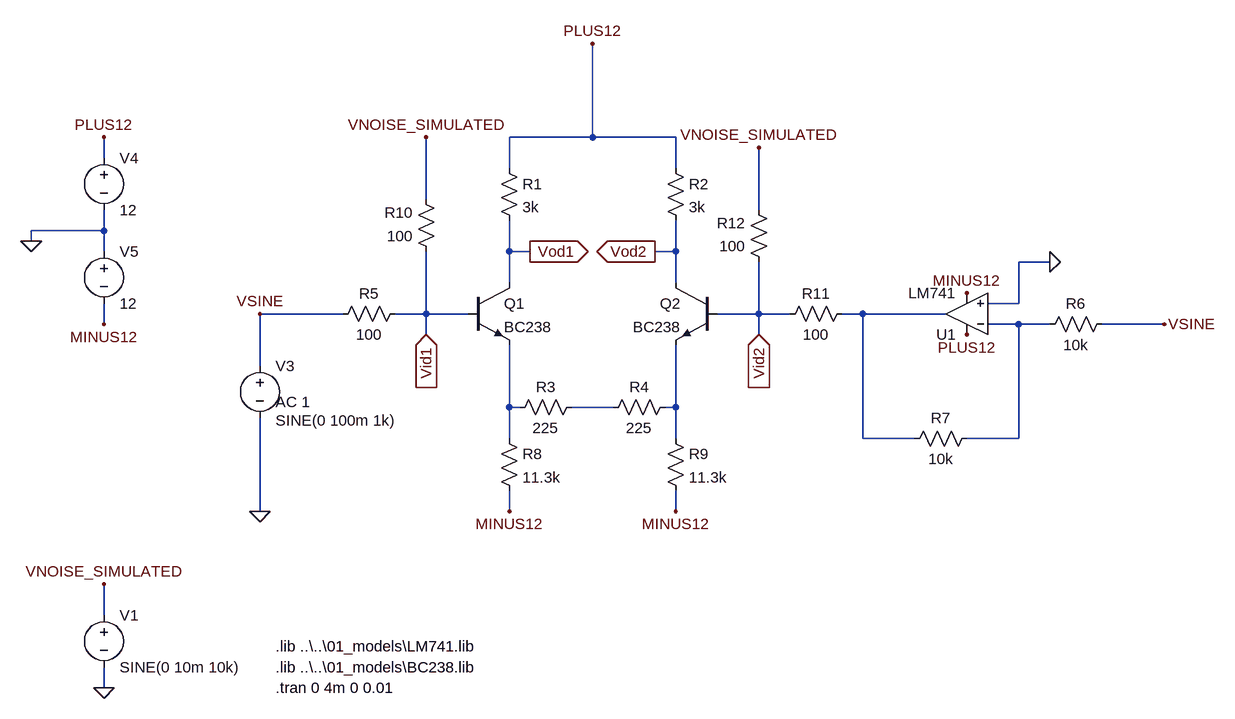
[diagram p0: schematic 02_diff_amp_tail_resistor_20201213_2225.asc]
02_diff_amp_tail_resistor_20201213_2225.asc, the LTspice schematic file:
Version 4
SHEET 1 1512 680
WIRE 32 -192 32 -336
WIRE 32 -192 -96 -192
WIRE 160 -192 32 -192
WIRE -720 -160 -720 -192
WIRE -96 -144 -96 -192
WIRE 160 -144 160 -192
WIRE -224 -96 -224 -192
WIRE 288 -80 288 -176
WIRE -720 -48 -720 -80
WIRE -720 -48 -832 -48
WIRE -832 -32 -832 -48
WIRE -720 -16 -720 -48
WIRE -96 -16 -96 -64
WIRE -64 -16 -96 -16
WIRE 160 -16 160 -64
WIRE 160 -16 128 -16
WIRE 736 0 688 0
WIRE -96 32 -96 -16
WIRE 160 32 160 -16
WIRE 688 64 688 0
WIRE 688 64 640 64
WIRE -352 80 -480 80
WIRE -224 80 -224 -16
WIRE -224 80 -272 80
WIRE -160 80 -224 80
WIRE 288 80 288 0
WIRE 288 80 224 80
WIRE 336 80 288 80
WIRE 448 80 416 80
WIRE 576 80 448 80
WIRE -720 96 -720 64
WIRE 688 96 640 96
WIRE 736 96 688 96
WIRE 912 96 816 96
WIRE -224 112 -224 80
WIRE 288 112 288 80
WIRE -480 160 -480 80
WIRE -96 224 -96 128
WIRE -80 224 -96 224
WIRE 64 224 0 224
WIRE 160 224 160 128
WIRE 160 224 144 224
WIRE -96 272 -96 224
WIRE 160 272 160 224
WIRE 448 272 448 80
WIRE 528 272 448 272
WIRE 688 272 688 96
WIRE 688 272 608 272
WIRE -480 384 -480 240
WIRE -96 384 -96 352
WIRE 160 384 160 352
WIRE -720 544 -720 496
WIRE -720 656 -720 624
FLAG -480 384 0
FLAG -832 -32 0
FLAG -720 -192 PLUS12
FLAG -720 96 MINUS12
FLAG 736 0 0
FLAG 608 48 MINUS12
FLAG 608 112 PLUS12
FLAG -96 384 MINUS12
FLAG 160 384 MINUS12
FLAG 32 -336 PLUS12
FLAG -480 80 VSINE
FLAG 912 96 VSINE
FLAG -720 656 0
FLAG -720 496 VNOISE_SIMULATED
FLAG -224 -192 VNOISE_SIMULATED
FLAG 288 -176 VNOISE_SIMULATED
FLAG -64 -16 Vod1
IOPIN -64 -16 Out
FLAG 128 -16 Vod2
IOPIN 128 -16 Out
FLAG -224 112 Vid1
IOPIN -224 112 In
FLAG 288 112 Vid2
IOPIN 288 112 In
SYMBOL res -112 -160 R0
SYMATTR InstName R1
SYMATTR Value 3k
SYMBOL res 144 -160 R0
SYMATTR InstName R2
SYMATTR Value 3k
SYMBOL voltage -480 144 R0
WINDOW 3 24 100 Left 2
WINDOW 123 24 72 Left 2
WINDOW 39 0 0 Left 2
SYMATTR Value SINE(0 100m 1k)
SYMATTR Value2 AC 1
SYMATTR InstName V3
SYMBOL voltage -720 -176 R0
SYMATTR InstName V4
SYMATTR Value 12
SYMBOL voltage -720 -32 R0
SYMATTR InstName V5
SYMATTR Value 12
SYMBOL npn -160 32 R0
SYMATTR InstName Q1
SYMATTR Value BC238
SYMBOL npn 224 32 M0
SYMATTR InstName Q2
SYMATTR Value BC238
SYMBOL res 16 208 R90
WINDOW 0 0 56 VBottom 2
WINDOW 3 32 56 VTop 2
SYMATTR InstName R3
SYMATTR Value 225
SYMBOL res 160 208 R90
WINDOW 0 0 56 VBottom 2
WINDOW 3 32 56 VTop 2
SYMATTR InstName R4
SYMATTR Value 225
SYMBOL OpAmps\\opamp2 608 144 R180
SYMATTR InstName U1
SYMATTR Value LM741
SYMBOL res 832 80 R90
WINDOW 0 0 56 VBottom 2
WINDOW 3 32 56 VTop 2
SYMATTR InstName R6
SYMATTR Value 10k
SYMBOL res 624 256 R90
WINDOW 0 0 56 VBottom 2
WINDOW 3 32 56 VTop 2
SYMATTR InstName R7
SYMATTR Value 10k
SYMBOL res -112 256 R0
SYMATTR InstName R8
SYMATTR Value 11.3k
SYMBOL res 144 256 R0
SYMATTR InstName R9
SYMATTR Value 11.3k
SYMBOL res -256 64 R90
WINDOW 0 0 56 VBottom 2
WINDOW 3 32 56 VTop 2
SYMATTR InstName R5
SYMATTR Value 100
SYMBOL res -208 0 R180
WINDOW 0 36 76 Left 2
WINDOW 3 36 40 Left 2
SYMATTR InstName R10
SYMATTR Value 100
SYMBOL res 432 64 R90
WINDOW 0 0 56 VBottom 2
WINDOW 3 32 56 VTop 2
SYMATTR InstName R11
SYMATTR Value 100
SYMBOL res 304 16 R180
WINDOW 0 36 76 Left 2
WINDOW 3 36 40 Left 2
SYMATTR InstName R12
SYMATTR Value 100
SYMBOL voltage -720 528 R0
WINDOW 123 0 0 Left 0
WINDOW 39 0 0 Left 0
SYMATTR InstName V1
SYMATTR Value SINE(0 10m 10k)
TEXT -456 656 Left 2 !.tran 0 4m 0 0.01
TEXT -456 624 Left 2 !.lib ..\\..\\01_models\\BC238.lib
TEXT -456 592 Left 2 !.lib ..\\..\\01_models\\LM741.lib

The netlist it stands for:
* 02_diff_amp_tail_resistor_20201213_2225.asc
R1 PLUS12 Vod1 3k
R2 PLUS12 Vod2 3k
V3 VSINE 0 SINE(0 100m 1k) AC 1
V4 PLUS12 0 12
V5 0 MINUS12 12
Q1 Vod1 Vid1 N003 0 BC238
Q2 Vod2 Vid2 N005 0 BC238
R3 N004 N003 225
R4 N005 N004 225
XU1 0 N002 PLUS12 MINUS12 N001 LM741  ; pins In+ In- V+ V- OUT
R6 VSINE N002 10k
R7 N002 N001 10k
R8 N003 MINUS12 11.3k
R9 N005 MINUS12 11.3k
R5 Vid1 VSINE 100
R10 Vid1 VNOISE_SIMULATED 100
R11 N001 Vid2 100
R12 Vid2 VNOISE_SIMULATED 100
V1 VNOISE_SIMULATED 0 SINE(0 10m 10k)
.model NPN NPN
.model PNP PNP
.lib standard.bjt
.tran 0 4m 0 0.01
.lib ..\..\01_models\BC238.lib
.lib ..\..\01_models\LM741.lib
.backanno
.end